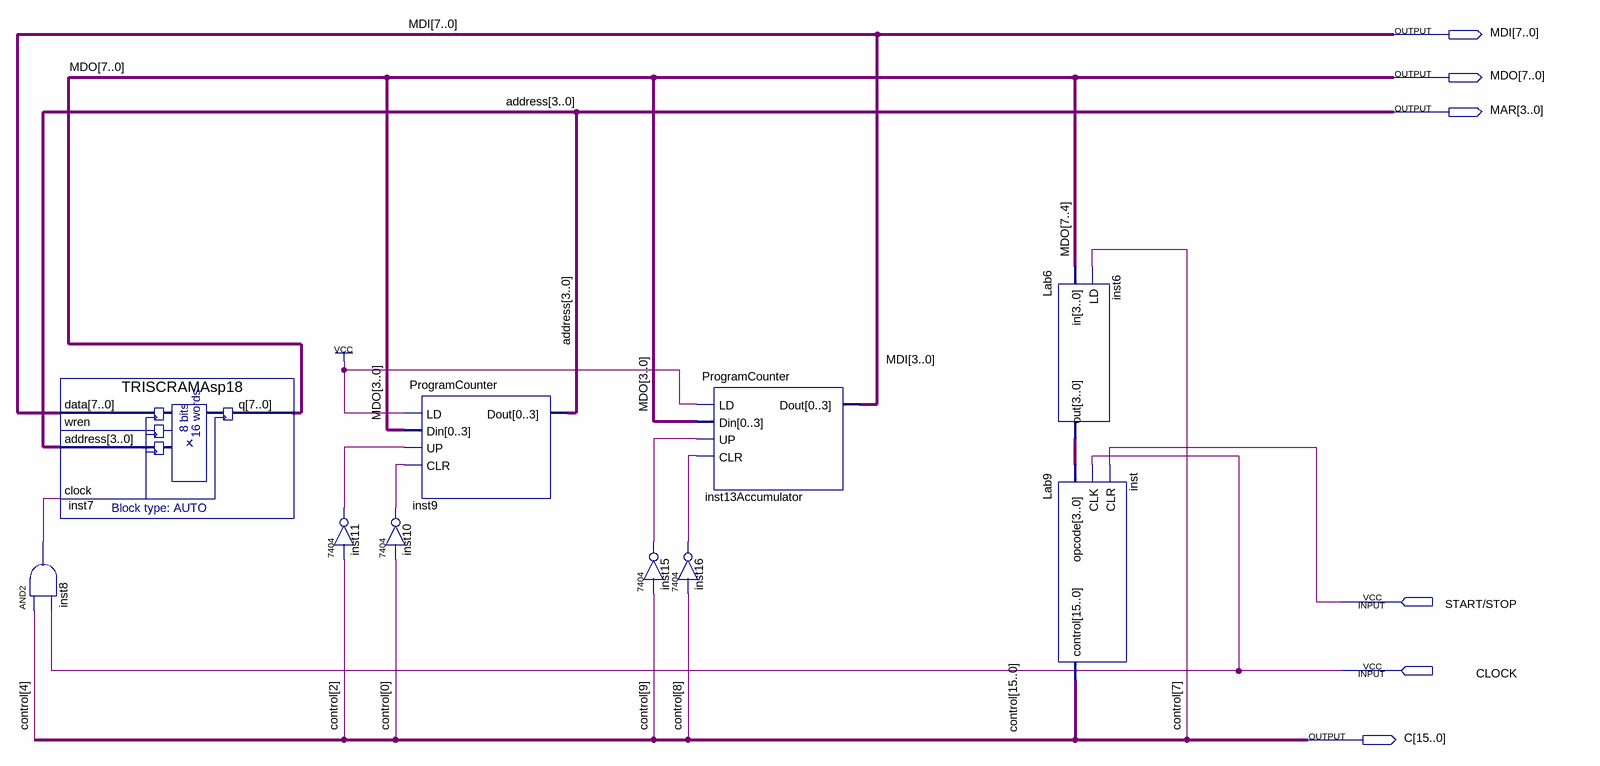
[diagram p0: schematic sheet]
// Quartus schematic FP_PartA.bdf as structural Verilog: 10 symbols, 6 pins
module FP_PartA (
  input  \START/STOP ,
  input  CLOCK,
  output [7:0] MDI,
  output [7:0] MDO,
  output [3:0] MAR,
  output [15:0] C
);

  wire inst8_out, inst10_1, inst11_1, inst15_1, inst16_1;
  wire [3:0] inst6_out;

  and inst8 (inst8_out, C[4], CLOCK);
  TRISCRAMAsp18 inst7 (.data(MDI), .address(MAR), .clock(inst8_out), .q(MDO));  // open: wren
  \7404  inst11 (.\2 (C[2]), .\1 (inst11_1));
  ProgramCounter inst9 (.LD(1'b1), .Din(MDO[3:0]), .UP(inst11_1), .CLR(inst10_1), .Dout(MAR));
  \7404  inst10 (.\2 (C[0]), .\1 (inst10_1));
  \7404  inst15 (.\2 (C[9]), .\1 (inst15_1));
  ProgramCounter inst13Accumulator (.LD(1'b1), .Din(MDO[3:0]), .UP(inst15_1), .CLR(inst16_1), .Dout(MDI[3:0]));
  \7404  inst16 (.\2 (C[8]), .\1 (inst16_1));
  Lab6 inst6 (.in(MDO[7:4]), .LD(C[7]), .out(inst6_out));
  Lab9 inst (.opcode(inst6_out), .CLK(CLOCK), .CLR(\START/STOP ), .control(C));

  // Other names for the same wires on the sheet: address[3:0] = MAR; control[15:0] = C
endmodule
